# Altium project main_board.PrjPcb
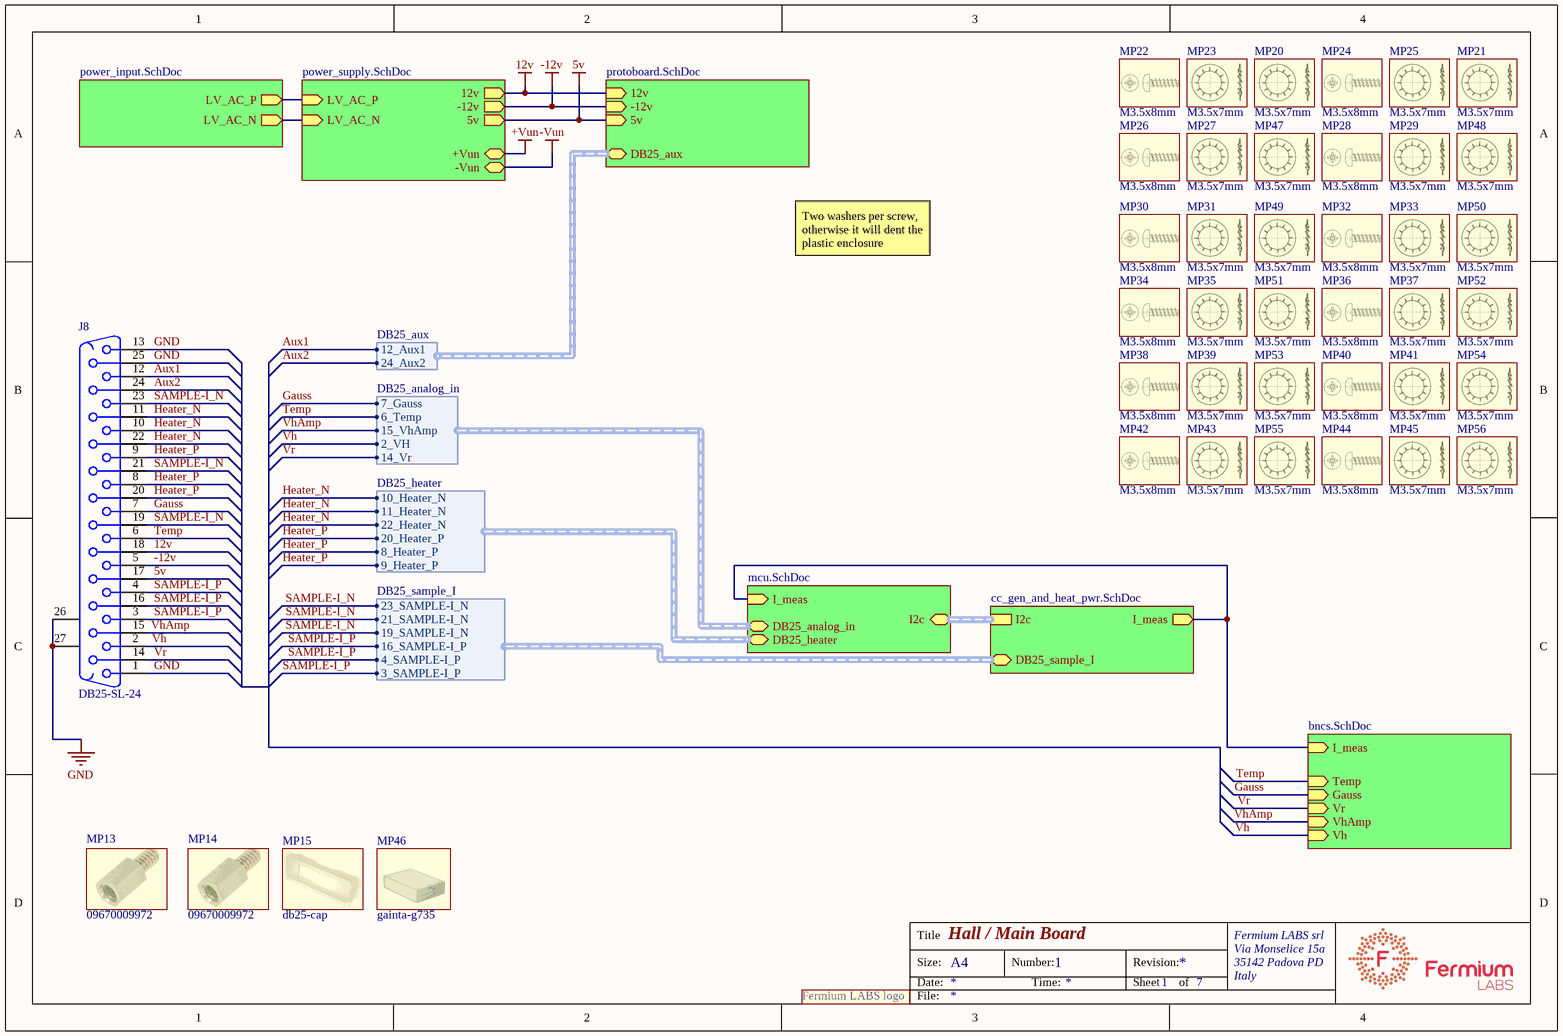
[diagram p0: main_board.SchDoc]
3 sheets, 105 parts. Net scope: hierarchical (ports join the sheet entries above them; power ports are global).
Board file: main_board.PcbDoc
Sheets:
  main_board.SchDoc
     = bncs.SchDoc
     = power_supply.SchDoc

## Sheet main_board.SchDoc: Hall / Main Board
size A4; DocumentNumber: 1; SheetNumber: 1; SheetTotal: 7

### Parts
J8  Supplier Part Number 1: DB25-SL-24  [DB25]
logo  (no value)  [frm-med]  (no BOM)
MP13  09670009972  (mechanical)
MP14  09670009972  (mechanical)
MP15  db25-cap  (mechanical)
MP20  Size: M3.5x7mm  (hidden comment: rondella-dentata-m3.5_1)  (mechanical)
MP21  Size: M3.5x7mm  (hidden comment: rondella-dentata-m3.5_1)  (mechanical)
MP22  Size: M3.5x8mm  (hidden comment: screw-3.5x8-plasticc_1)  (mechanical)
MP23  Size: M3.5x7mm  (hidden comment: rondella-dentata-m3.5_1)  (mechanical)
MP24  Size: M3.5x8mm  (hidden comment: screw-3.5x8-plasticc_1)  (mechanical)
MP25  Size: M3.5x7mm  (hidden comment: rondella-dentata-m3.5_1)  (mechanical)
MP26  Size: M3.5x8mm  (hidden comment: screw-3.5x8-plasticc_1)  (mechanical)
MP27  Size: M3.5x7mm  (hidden comment: rondella-dentata-m3.5_1)  (mechanical)
MP28  Size: M3.5x8mm  (hidden comment: screw-3.5x8-plasticc_1)  (mechanical)
MP29  Size: M3.5x7mm  (hidden comment: rondella-dentata-m3.5_1)  (mechanical)
MP30  Size: M3.5x8mm  (hidden comment: screw-3.5x8-plasticc_1)  (mechanical)
MP31  Size: M3.5x7mm  (hidden comment: rondella-dentata-m3.5_1)  (mechanical)
MP32  Size: M3.5x8mm  (hidden comment: screw-3.5x8-plasticc_1)  (mechanical)
MP33  Size: M3.5x7mm  (hidden comment: rondella-dentata-m3.5_1)  (mechanical)
MP34  Size: M3.5x8mm  (hidden comment: screw-3.5x8-plasticc_1)  (mechanical)
MP35  Size: M3.5x7mm  (hidden comment: rondella-dentata-m3.5_1)  (mechanical)
MP36  Size: M3.5x8mm  (hidden comment: screw-3.5x8-plasticc_1)  (mechanical)
MP37  Size: M3.5x7mm  (hidden comment: rondella-dentata-m3.5_1)  (mechanical)
MP38  Size: M3.5x8mm  (hidden comment: screw-3.5x8-plasticc_1)  (mechanical)
MP39  Size: M3.5x7mm  (hidden comment: rondella-dentata-m3.5_1)  (mechanical)
MP40  Size: M3.5x8mm  (hidden comment: screw-3.5x8-plasticc_1)  (mechanical)
MP41  Size: M3.5x7mm  (hidden comment: rondella-dentata-m3.5_1)  (mechanical)
MP42  Size: M3.5x8mm  (hidden comment: screw-3.5x8-plasticc_1)  (mechanical)
MP43  Size: M3.5x7mm  (hidden comment: rondella-dentata-m3.5_1)  (mechanical)
MP44  Size: M3.5x8mm  (hidden comment: screw-3.5x8-plasticc_1)  (mechanical)
MP45  Size: M3.5x7mm  (hidden comment: rondella-dentata-m3.5_1)  (mechanical)
MP46  gainta-g735  (mechanical)
MP47  Size: M3.5x7mm  (hidden comment: rondella-dentata-m3.5_1)  (mechanical)
MP48  Size: M3.5x7mm  (hidden comment: rondella-dentata-m3.5_1)  (mechanical)
MP49  Size: M3.5x7mm  (hidden comment: rondella-dentata-m3.5_1)  (mechanical)
MP50  Size: M3.5x7mm  (hidden comment: rondella-dentata-m3.5_1)  (mechanical)
MP51  Size: M3.5x7mm  (hidden comment: rondella-dentata-m3.5_1)  (mechanical)
MP52  Size: M3.5x7mm  (hidden comment: rondella-dentata-m3.5_1)  (mechanical)
MP53  Size: M3.5x7mm  (hidden comment: rondella-dentata-m3.5_1)  (mechanical)
MP54  Size: M3.5x7mm  (hidden comment: rondella-dentata-m3.5_1)  (mechanical)
MP55  Size: M3.5x7mm  (hidden comment: rondella-dentata-m3.5_1)  (mechanical)
MP56  Size: M3.5x7mm  (hidden comment: rondella-dentata-m3.5_1)  (mechanical)

### Sub-sheets
? = bncs.SchDoc: Temp (in), Gauss (in), I_meas (in), Vr (in), VhAmp (in), Vh (in)
? = mcu.SchDoc (file not in this document): I2c (harness I2c), I_meas (in), DB25_analog_in (harness DB25_analog_in), DB25_heater (harness DB25_heater)
? = power_supply.SchDoc: 12v (out), -12v (out), 5v (out), LV_AC_P (in), LV_AC_N (in), +Vun, -Vun
? = cc_gen_and_heat_pwr.SchDoc (file not in this document): I2c (harness I2c), I_meas (out), DB25_sample_I (harness DB25_sample_I)
? = protoboard.SchDoc (file not in this document): 12v (in), -12v (in), 5v (in), DB25_aux (harness DB25_aux)
? = power_input.SchDoc (file not in this document): LV_AC_P (out), LV_AC_N (out)

### Harnesses
DB25_analog_in: 14_Vr, 15_VhAmp, 2_VH, 6_Temp, 7_Gauss
DB25_heater: 10_Heater_N, 11_Heater_N, 20_Heater_P, 22_Heater_N, 8_Heater_P, 9_Heater_P
DB25_sample_I: 16_SAMPLE-I_P, 19_SAMPLE-I_N, 21_SAMPLE-I_N, 23_SAMPLE-I_N, 3_SAMPLE-I_P, 4_SAMPLE-I_P
DB25_aux: 12_Aux1, 24_Aux2

### Nets
5v: J8.17 ; sheet /5v, sheet /5v
12v: J8.18 ; sheet /12v, sheet /12v
-12v: J8.5 ; sheet /-12v, sheet /-12v
GND: J8.1 J8.13 J8.25 J8.26(MH1) J8.27(MH2)
Aux1: J8.12 ; sheet /DB25_aux.12_Aux1
Aux2: J8.24 ; sheet /DB25_aux.24_Aux2
Gauss: J8.7 ; sheet /Gauss, sheet /DB25_analog_in.7_Gauss
Heater_N: J8.10 J8.11 J8.22 ; sheet /DB25_heater.10_Heater_N, sheet /DB25_heater.11_Heater_N, sheet /DB25_heater.22_Heater_N
Heater_P: J8.8 J8.9 J8.20 ; sheet /DB25_heater.20_Heater_P, sheet /DB25_heater.8_Heater_P, sheet /DB25_heater.9_Heater_P
SAMPLE-I_N: J8.19 J8.21 J8.23 ; sheet /DB25_sample_I.19_SAMPLE-I_N, sheet /DB25_sample_I.21_SAMPLE-I_N, sheet /DB25_sample_I.23_SAMPLE-I_N
SAMPLE-I_P: J8.3 J8.4 J8.16 ; sheet /DB25_sample_I.16_SAMPLE-I_P, sheet /DB25_sample_I.3_SAMPLE-I_P, sheet /DB25_sample_I.4_SAMPLE-I_P
Temp: J8.6 ; sheet /Temp, sheet /DB25_analog_in.6_Temp
Vh: J8.2 ; sheet /Vh, sheet /DB25_analog_in.2_VH
VhAmp: J8.15 ; sheet /VhAmp, sheet /DB25_analog_in.15_VhAmp
Vr: J8.14 ; sheet /Vr, sheet /DB25_analog_in.14_Vr
NetD1_A: sheet /I_meas, sheet /I_meas, sheet /I_meas
NetD19_A: sheet /LV_AC_P, sheet /LV_AC_P
NetD20_A: sheet /LV_AC_N, sheet /LV_AC_N

### Notes on the sheet
- Two washers per screw, otherwise it will dent the plastic enclosure
- Title
- Size:
- Date:
- A4
- Number:
- Time:
- Revision:
- Sheet
- of
- Fermium LABS srl
- Via Monselice 15a
- 35142 Padova PD
- Italy
- File:
- (in symbol fermiumlabs-logo) Fermium LABS logo

### Library data of the parts
J8 = D Connector 25: d-sub, 25 pins,  Right Angle; Manufacturer: ADAM TECH; Pads: 29 THT; Supplier 1: TME; Manufacturer Part Number: DB25-SL-24; Category: D-Sub connectors
logo = fermiumlabs-logo
MP13 MP14 = 09670009972: Manufacturer: HARTING; Supplier 1: TME; Supplier Part Number 1: 09670009972; Manufacturer Part Number: 09670009972
MP15 = db25-cap: Manufacturer Part Number: 2105-0100-03; Manufacturer: Encitech; Supplier 1: TME; Supplier Part Number 1: DC25-P
MP20 MP21 MP23 MP25 MP27 MP29 MP31 MP33 MP35 MP37 MP39 MP41 MP43 MP45 MP47-MP56 = rondella-dentata-m3.5_1: Manufacturer Part Number: M3.5/BN782 DIN6798J; Manufacturer: BOSSARD; Supplier 1: TME; Supplier Part Number 1: B3.5/BN782
MP22 MP24 MP26 MP28 MP30 MP32 MP34 MP36 MP38 MP40 MP42 MP44 = screw-3.5x8-plasticc_1: Manufacturer Part Number: M3.5X8/BN82428; Manufacturer: BOSSARD; Supplier 1: TME; Supplier Part Number 1: B3.5X8/BN82428
MP46 = gainta-g735: Manufacturer Part Number: G735; Manufacturer: GAINTA; Supplier 1: TME; Supplier Part Number 1: G735

## Sheet bncs.SchDoc: Hall / Main Board / BNCs
size A4; DocumentNumber: 2; SheetNumber: 2; SheetTotal: 7
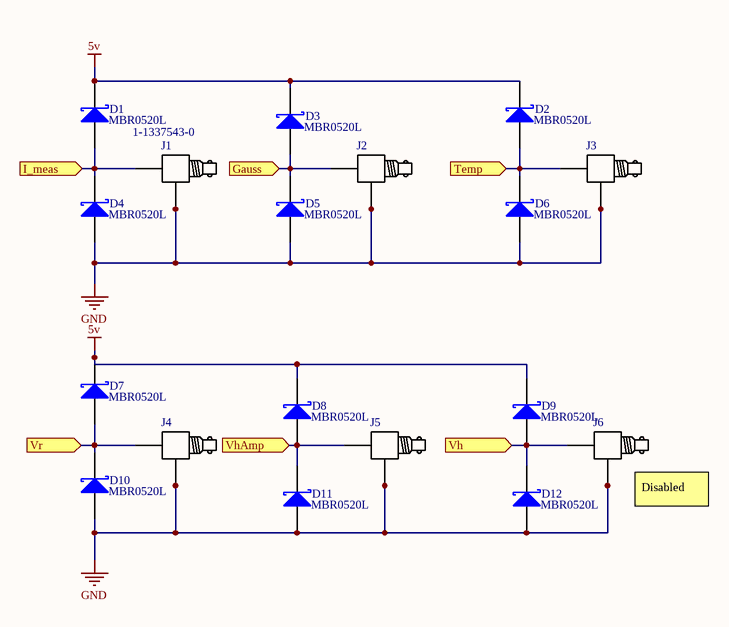
[diagram p1: bncs.SchDoc]

### Parts
D1  Supplier Part Number 1: MBR0520L  [SOD123]
D2  Supplier Part Number 1: MBR0520L  [SOD123]
D3  Supplier Part Number 1: MBR0520L  [SOD123]
D4  Supplier Part Number 1: MBR0520L  [SOD123]
D5  Supplier Part Number 1: MBR0520L  [SOD123]
D6  Supplier Part Number 1: MBR0520L  [SOD123]
D7  Supplier Part Number 1: MBR0520L  [SOD123]
D8  Supplier Part Number 1: MBR0520L  [SOD123]
D9  Supplier Part Number 1: MBR0520L  [SOD123]
D10  Supplier Part Number 1: MBR0520L  [SOD123]
D11  Supplier Part Number 1: MBR0520L  [SOD123]
D12  Supplier Part Number 1: MBR0520L  [SOD123]
J1  Supplier Part Number 1: 1-1337543-0  [BNC-RA]
J2  (no value)  [BNC-RA]
J3  (no value)  [BNC-RA]
J4  (no value)  [BNC-RA]
J5  (no value)  [BNC-RA]
J6  (no value)  [BNC-RA]

### Ports
Gauss (in), I_meas (in), Temp (in), Vh (in), VhAmp (in), Vr (in)

### Nets
5v: D1.K D2.K D3.K D7.K D8.K D9.K
GND: D4.A D5.A D6.A D10.A D11.A D12.A J1.2(gnd) J1.A J1.B J2.2(gnd) J2.A J2.B J3.2(gnd) J3.A J3.B J4.2(gnd) J4.A J4.B J5.2(gnd) J5.A J5.B J6.2(gnd) J6.A J6.B
Gauss: D3.A D5.K J2.1 ; port Gauss
Temp: D2.A D6.K J3.1 ; port Temp
Vh: D9.A D12.K J6.1 ; port Vh
VhAmp: D8.A D11.K J5.1 ; port VhAmp
Vr: D7.A D10.K J4.1 ; port Vr
NetD1_A: D1.A D4.K J1.1 ; port I_meas

### Notes on the sheet
- (near J6) Disabled
- Title
- Size:
- Date:
- A4
- Number:
- Time:
- Revision:
- Sheet
- of
- Fermium LABS srl
- Via Monselice 15a
- 35142 Padova PD
- Italy
- File:

### Library data of the parts
D1-D9 D11 D12 = D Schottky: Schottky Diode; Manufacturer: FAIRCHILD SEMICONDUCTOR; Unit: pcs; SuppliedAmount: 0; MinAmount: 10; Multiples: 1; Diode type: Schottky rectifying; Off state voltage max.: 20V; Forward voltage at If: 390mV; Load current: 500mA; Pads: 2 SMD; Published: 8-Jun-2000; LatestRevisionDate: 17-Jul-2002; LatestRevisionNote: Re-released for DXP Platform.; PackageReference: SMB; Publisher: Altium Limited; PackageDescription: DO-214-AA/SMB; 2 C-Bend Leads; Body 5.3 x 3.6 mm, inc. leads (LxW); Code_JEDEC: DO-214-AA; Supplier 1: TME; Manufacturer Part Number: MBR0520L; Category: SMD Schottky Diodes; Stock 1: 24595; Pricing 1: 10=0.0403, 50=0.0376, 250=0.0333, 1000=0.03, 3000=0.0281 (EUR); Weight: 0.032; Case: SOD123; Mounting: SMD; Price Type: NET; ComponentLink1URL: http://static.tme.eu/products_pics/e/d/b/edbd030cb344fc64745afa0f91101952/285567.jpg; ComponentLink1Description: http://static.tme.eu/products_pics/e/d/b/edbd030cb344fc64745afa0f91101952/285567.jpg
D10 = D Schottky: Schottky Diode; Manufacturer: FAIRCHILD SEMICONDUCTOR; Unit: pcs; SuppliedAmount: 0; MinAmount: 10; Multiples: 1; Diode type: Schottky rectifying; Off state voltage max.: 20V; Forward voltage at If: 390mV; Load current: 500mA; 2: SMD; Pads: 2 SMD; Published: 8-Jun-2000; LatestRevisionDate: 17-Jul-2002; LatestRevisionNote: Re-released for DXP Platform.; PackageReference: SMB; Publisher: Altium Limited; PackageDescription: DO-214-AA/SMB; 2 C-Bend Leads; Body 5.3 x 3.6 mm, inc. leads (LxW); Code_JEDEC: DO-214-AA; Supplier 1: TME; Manufacturer Part Number: MBR0520L; Category: SMD Schottky Diodes; Stock 1: 24595; Pricing 1: 10=0.0403, 50=0.0376, 250=0.0333, 1000=0.03, 3000=0.0281 (EUR); Weight: 0.032; Case: SOD123; Mounting: SMD; Price Type: NET; ComponentLink1URL: http://static.tme.eu/products_pics/e/d/b/edbd030cb344fc64745afa0f91101952/285567.jpg; ComponentLink1Description: http://static.tme.eu/products_pics/e/d/b/edbd030cb344fc64745afa0f91101952/285567.jpg
J1 = BNC-PCB-RA: connector bnc; Manufacturer: TE CONNECTIVITY; Unit: pcs; SuppliedAmount: 0; MinAmount: 1; Connector: socket; Connector variant: insulated; Spatial orientation: angled 90°; Wave impedance: 50Ω; Electrical mounting: THT; Mechanical mounting: on PCBs; Insulator material: polyester; Pads: 4 THT; Supplier 1: TME; Manufacturer Part Number: 1-1337543-0; Category: BNC connectors; Stock 1: 44; Pricing 1: 1=1.22, 25=1.1, 100=0.98, 1000=0.86 (EUR); Weight: 13.22; Multiples: 1; Connector type: BNC; Contact plating: gold plated; Price Type: NET; ComponentLink1URL: http://static.tme.eu/products_pics/6/3/2/63240353f8a8790dbe8f7bd93b014c1a/378606.jpg; ComponentLink1Description: http://static.tme.eu/products_pics/6/3/2/63240353f8a8790dbe8f7bd93b014c1a/378606.jpg
J2-J6 = BNC-PCB-RA: connector bnc; Manufacturer: TE CONNECTIVITY; Manufacturer Part Number: 1-1337543-0; Unit: pcs; SuppliedAmount: 0; MinAmount: 1; Connector: socket; Connector variant: insulated; Spatial orientation: angled 90°; Wave impedance: 50Ω; Electrical mounting: THT; Mechanical mounting: on PCBs; Insulator material: polyester; Pads: 4 THT; Supplier 1: TME; Supplier Part Number 1: 1-1337543-0; Category: BNC connectors; Stock 1: 44; Pricing 1: 1=1.22, 25=1.1, 100=0.98, 1000=0.86 (EUR); Weight: 13.22; Multiples: 1; Connector type: BNC; Contact plating: gold plated; Price Type: NET; ComponentLink1URL: http://static.tme.eu/products_pics/6/3/2/63240353f8a8790dbe8f7bd93b014c1a/378606.jpg; ComponentLink1Description: http://static.tme.eu/products_pics/6/3/2/63240353f8a8790dbe8f7bd93b014c1a/378606.jpg

## Sheet power_supply.SchDoc: Hall / Main Board / Power Supply
size A4; DocumentNumber: 6; SheetNumber: 6; SheetTotal: 7
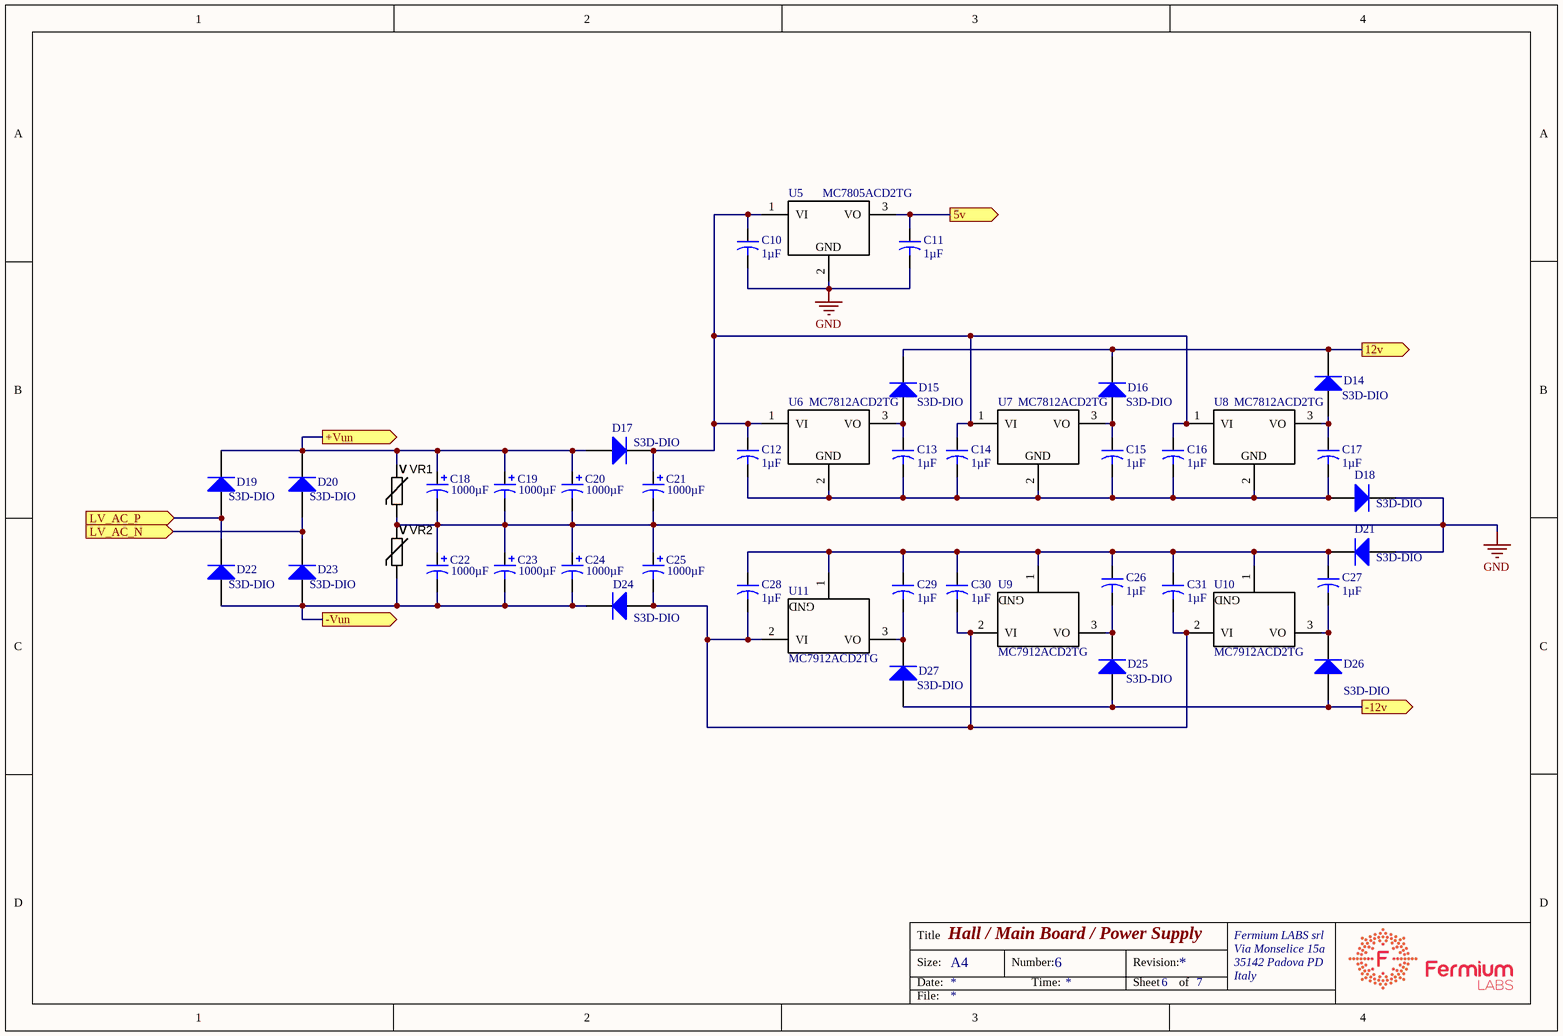
[diagram p2: power_supply.SchDoc]

### Parts
C10  Capacitance: 1µF  [CAP 0805/2012]
C11  Capacitance: 1µF  [CAP 0805/2012]
C12  Capacitance: 1µF  [CAP 0805/2012]
C13  Capacitance: 1µF  [CAP 0805/2012]
C14  Capacitance: 1µF  [CAP 0805/2012]
C15  Capacitance: 1µF  [CAP 0805/2012]
C16  Capacitance: 1µF  [CAP 0805/2012]
C17  Capacitance: 1µF  [CAP 0805/2012]
C18  Capacitance: 1000µF  [CAPE5.0mm]
C19  Capacitance: 1000µF  [CAPE5.0mm]
C20  Capacitance: 1000µF  [CAPE5.0mm]
C21  Capacitance: 1000µF  [CAPE5.0mm]
C22  Capacitance: 1000µF  [CAPE5.0mm]
C23  Capacitance: 1000µF  [CAPE5.0mm]
C24  Capacitance: 1000µF  [CAPE5.0mm]
C25  Capacitance: 1000µF  [CAPE5.0mm]
C26  Capacitance: 1µF  [CAP 0805/2012]
C27  Capacitance: 1µF  [CAP 0805/2012]
C28  Capacitance: 1µF  [CAP 0805/2012]
C29  Capacitance: 1µF  [CAP 0805/2012]
C30  Capacitance: 1µF  [CAP 0805/2012]
C31  Capacitance: 1µF  [CAP 0805/2012]
D14  Supplier Part Number 1: S3D-DIO  [DIODE-SMC]
D15  Supplier Part Number 1: S3D-DIO  [DIODE-SMC]
D16  Supplier Part Number 1: S3D-DIO  [DIODE-SMC]
D17  Supplier Part Number 1: S3D-DIO  [DIODE-SMC]
D18  Supplier Part Number 1: S3D-DIO  [DIODE-SMC]
D19  Supplier Part Number 1: S3D-DIO  [DIODE-SMC]
D20  Supplier Part Number 1: S3D-DIO  [DIODE-SMC]
D21  Supplier Part Number 1: S3D-DIO  [DIODE-SMC]
D22  Supplier Part Number 1: S3D-DIO  [DIODE-SMC]
D23  Supplier Part Number 1: S3D-DIO  [DIODE-SMC]
D24  Supplier Part Number 1: S3D-DIO  [DIODE-SMC]
D25  Supplier Part Number 1: S3D-DIO  [DIODE-SMC]
D26  Supplier Part Number 1: S3D-DIO  [DIODE-SMC]
D27  Supplier Part Number 1: S3D-DIO  [DIODE-SMC]
U5  Supplier Part Number 1: MC7805ACD2TG  [D2PAK-3]
U6  Supplier Part Number 1: MC7812ACD2TG  [D2PAK-3]
U7  Supplier Part Number 1: MC7812ACD2TG  [D2PAK-3]
U8  Supplier Part Number 1: MC7812ACD2TG  [D2PAK-3]
U9  Supplier Part Number 1: MC7912ACD2TG  [D2PAK-3]
U10  Supplier Part Number 1: MC7912ACD2TG  [D2PAK-3]
U11  Supplier Part Number 1: MC7912ACD2TG  [D2PAK-3]
VR1  (no value)  [CAP 1206/3216 - 1.8MM]
VR2  (no value)  [CAP 1206/3216 - 1.8MM]

### Ports
5v (out), 12v (out), +Vun (out), -12v (out), -Vun (out), LV_AC_N (in), LV_AC_P (in)

### Nets
5v: C11.1 U5.3(VO) ; port 5v
12v: D14.K D15.K D16.K ; port 12v
+Vun: C18.1 C19.1 C20.1 D17.A D19.K D20.K VR1.1 ; port +Vun
-12v: D25.A D26.A D27.A ; port -12v
-Vun: C22.2 C23.2 C24.2 D22.A D23.A D24.K VR2.2 ; port -Vun
GND: C10.2 C11.2 C18.2 C19.2 C20.2 C21.2 C22.1 C23.1 C24.1 C25.1 D18.K D21.A U5.2 VR1.2 VR2.1
NetC10_1: C10.1 C12.1 C14.1 C16.1 C21.1 D17.K U5.1(VI) U6.1(VI) U7.1(VI) U8.1(VI)
NetC12_2: C12.2 C13.2 C14.2 C15.2 C16.2 C17.2 D18.A U6.2 U7.2 U8.2
NetC13_1: C13.1 D15.A U6.3(VO)
NetC15_1: C15.1 D16.A U7.3(VO)
NetC17_1: C17.1 D14.A U8.3(VO)
NetC25_2: C25.2 C28.2 C30.2 C31.2 D24.A U9.2(VI) U10.2(VI) U11.2(VI)
NetC26_1: C26.1 C27.1 C28.1 C29.1 C30.1 C31.1 D21.K U9.1 U10.1 U11.1
NetC26_2: C26.2 D25.K U9.3(VO)
NetC27_2: C27.2 D26.K U10.3(VO)
NetC29_2: C29.2 D27.K U11.3(VO)
NetD19_A: D19.A D22.K ; port LV_AC_P
NetD20_A: D20.A D23.K ; port LV_AC_N

### Notes on the sheet
- Title
- Size:
- Date:
- A4
- Number:
- Time:
- Revision:
- Sheet
- of
- Fermium LABS srl
- Via Monselice 15a
- 35142 Padova PD
- Italy
- File:
- (in symbol L7805-TO220) GND
- (in symbol L7815-TO220) GND
- (in symbol L7915-TO220) GND
- (in symbol Varistor_MOV) V

### Library data of the parts
C10-C17 C26-C31 = Cap2: Capacitor; Manufacturer: SAMSUNG; Manufacturer Part Number: CL21B105KAFNNNE; Unit: pcs; SuppliedAmount: 0; MinAmount: 100; Capacitor type: ceramic; Capacitor kind: MLCC; Operating voltage: 25V; Dielectric: X7R; Tolerance: ±10%; Case - inch: 0805; Case - mm: 2012; Pads: 2 SMD; Published: 23-Sep-2002; PackageReference: CAPR5-4X5; Publisher: Altium Limited; PackageDescription: Capacitor; 2 Leads; Supplier 1: TME; Supplier Part Number 1: CL21B105KAFNNNE; Category: 0805 MLCC SMD Capacitors; Stock 1: 56790; Pricing 1: 100=0.0108, 300=0.00924, 1000=0.00748, 2000=0.006, 6000=0.0058 (EUR); Weight: 0.039; Multiples: 100; Mounting: SMD; Operating temperature: -55...125°C; Price Type: NET; ComponentLink1URL: http://static.tme.eu/products_pics/d/b/b/dbbd93eaf25225110ca26eb66da77328/58538.jpg; ComponentLink1Description: http://static.tme.eu/products_pics/d/b/b/dbbd93eaf25225110ca26eb66da77328/58538.jpg
C18-C24 = Cap Pol1: capacitor , electrolytic; Manufacturer: United Chemi-Con; Manufacturer Part Number: EKYB250ELL102MJ20S; Pads: 2 THT; Description: Aluminum Electrolytic Capacitors - Leaded 25V 1000uF 20% Tol.; Featured Product: United Chemi-Con - KYB Series Aluminum Electrolytic Capacitors; Tolerance: ±20%; Voltage Rating: 25V; Lifetime @ Temp.: 10000 Hrs @ 105°C; Ripple Current: 1.65A; Impedance: 37 mOhm; Online Catalog: KYB Series; Other Names: 565-3892; Supplier 1: Mouser; Supplier Part Number 1: 661-EKYB250E102MJ20S; Stock 1: 908; Pricing 1: 1=0.69, 10=0.507, 50=0.387, 100=0.348, 1000=0.232, 10000=0.187 (USD); Standard Package: 2,000; Category: Capacitors; Family: Aluminum Capacitors; Series: KYB; Packaging: Bulk; ESR (Equivalent Series Resistance): -; Operating Temperature: -40°C ~ 105°C; Polarization: -; Applications: General Purpose; Lead Spacing: 0.197" (5.00mm); Size / Dimension: 0.394" Dia (10.00mm); Height - Seated (Max): 0.846" (21.50mm); Surface Mount Land Size: -; Mounting Type: Through Hole; Package / Case: Radial, Can; ComponentLink1URL: https://datasheet.ciiva.com/31837/al-kyb-bulletin826a-e-121112-31837781.pdf; ComponentLink1Description: https://datasheet.ciiva.com/31837/al-kyb-bulletin826a-e-121112-31837781.pdf
C25 = Cap Pol1: capacitor , electrolytic; Manufacturer: United Chemi-Con; Manufacturer Part Number: EKYB250ELL102MJ20S; Description: Aluminum Electrolytic Capacitors - Leaded 25V 1000uF 20% Tol.; Featured Product: United Chemi-Con - KYB Series Aluminum Electrolytic Capacitors; Tolerance: ±20%; Voltage Rating: 25V; Lifetime @ Temp.: 10000 Hrs @ 105°C; Ripple Current: 1.65A; Impedance: 37 mOhm; Online Catalog: KYB Series; Other Names: 565-3892; Supplier 1: Mouser; Supplier Part Number 1: 661-EKYB250E102MJ20S; Stock 1: 908; Pricing 1: 1=0.69, 10=0.507, 50=0.387, 100=0.348, 1000=0.232, 10000=0.187 (USD); Standard Package: 2,000; Category: Capacitors; Family: Aluminum Capacitors; Series: KYB; Packaging: Bulk; ESR (Equivalent Series Resistance): -; Operating Temperature: -40°C ~ 105°C; Polarization: -; Applications: General Purpose; Lead Spacing: 0.197" (5.00mm); Size / Dimension: 0.394" Dia (10.00mm); Height - Seated (Max): 0.846" (21.50mm); Surface Mount Land Size: -; Mounting Type: Through Hole; Package / Case: Radial, Can; ComponentLink1URL: https://datasheet.ciiva.com/31837/al-kyb-bulletin826a-e-121112-31837781.pdf; ComponentLink1Description: https://datasheet.ciiva.com/31837/al-kyb-bulletin826a-e-121112-31837781.pdf
D14-D27 = Diode 1N4007: Diode rectifier 1A; Manufacturer: DIOTEC SEMICONDUCTOR; Manufacturer Part Number: S3D; Pads: 2 SMD; Supplier 1: TME; Case: DO214AB
U5 = L7805-TO220: Voltage regulator, 5V; Manufacturer: ON SEMICONDUCTOR; Unit: pcs; SuppliedAmount: 0; MinAmount: 2; Multiples: 1; Integrated circuit type: voltage stabiliser; Kind of voltage regulator: fixed; Output current: 1A; Pads: 3 SMD; Supplier 1: TME; Manufacturer Part Number: MC7805ACD2TG; Category: Unregulated Voltage Regulators; Stock 1: 245; Pricing 1: 2=0.45, 10=0.42, 50=0.38, 250=0.322 (EUR); Weight: 2.18; Output voltage: 5V; Case: D2PAK; Mounting: SMD; Package type: tube; Price Type: NET; ComponentLink1URL: http://static.tme.eu/products_pics/e/a/8/ea8bf400c57f85e1fa510dcd027ce484/59301.jpg; ComponentLink1Description: http://static.tme.eu/products_pics/e/a/8/ea8bf400c57f85e1fa510dcd027ce484/59301.jpg
U6-U8 = L7815-TO220: Voltage regulator, 15V; Manufacturer: ON SEMICONDUCTOR; Unit: pcs; SuppliedAmount: 0; MinAmount: 1; Integrated circuit type: voltage stabiliser; Kind of voltage regulator: fixed; Output voltage: 12V; Output current: 1A; Pads: 3 SMD; Supplier 1: TME; Manufacturer Part Number: MC7812ACD2TG; Category: Unregulated Voltage Regulators; Stock 1: 415; Pricing 1: 1=0.5, 5=0.449, 25=0.41, 100=0.357, 500=0.299 (EUR); Weight: 1.997; Multiples: 1; Case: D2PAK; Mounting: SMD; Package type: tube; Price Type: NET; ComponentLink1URL: http://static.tme.eu/products_pics/e/a/8/ea8bf400c57f85e1fa510dcd027ce484/59301.jpg; ComponentLink1Description: http://static.tme.eu/products_pics/e/a/8/ea8bf400c57f85e1fa510dcd027ce484/59301.jpg
U9-U11 = L7915-TO220: Voltage regulator-15.0V; Manufacturer: ON SEMICONDUCTOR; Unit: pcs; SuppliedAmount: 0; MinAmount: 1; Integrated circuit type: voltage stabiliser; Kind of voltage regulator: fixed; Output voltage: -12V; Output current: 1A; Pads: 3 SMD; Supplier 1: TME; Manufacturer Part Number: MC7912ACD2TG; Category: Unregulated Voltage Regulators; Stock 1: 441; Pricing 1: 1=0.628, 5=0.56, 25=0.465, 100=0.39, 500=0.34 (EUR); Weight: 1.876; Multiples: 1; Case: D2PAK; Mounting: SMD; Package type: tube; Price Type: NET; ComponentLink1URL: http://static.tme.eu/products_pics/e/a/8/ea8bf400c57f85e1fa510dcd027ce484/59301.jpg; ComponentLink1Description: http://static.tme.eu/products_pics/e/a/8/ea8bf400c57f85e1fa510dcd027ce484/59301.jpg
VR1 VR2 = Varistor_MOV: Varistor; Manufacturer: EPCOS; Manufacturer Part Number: B72520T0250K062; Unit: pcs; SuppliedAmount: 0; MinAmount: 5; Multiples: 1; Varistor type: metal-oxide; Max. operating voltage: 25V AC; Energy 2 ms: 1J; Varistor max current 8/20µs: 200A; Power: 8mW; Pads: 2 SMD; Supplier 1: TME; Supplier Part Number 1: B72520T250K62; Category: SMD Varistors; Stock 1: 1646; Pricing 1: 5=0.194, 50=0.158, 100=0.128, 500=0.119, 2000=0.114 (EUR); Weight: 0.058; Mounting: SMD; Case: 1206; Price Type: NET; ComponentLink1URL: http://static.tme.eu/products_pics/c/0/9/c09a96f753270fa18ba9e61c943ff8c8/58311.jpg; ComponentLink1Description: http://static.tme.eu/products_pics/c/0/9/c09a96f753270fa18ba9e61c943ff8c8/58311.jpg

## Nets that join several sheets
5v: main_board (J8.17), bncs (6 pins), power_supply (C11.1 U5.3)
12v: main_board (J8.18), power_supply (D14.K D15.K D16.K)
-12v: main_board (J8.5), power_supply (D25.A D26.A D27.A)
GND: main_board (5 pins), bncs (24 pins), power_supply (15 pins)
Gauss: main_board (J8.7), bncs (D3.A D5.K J2.1)
Temp: main_board (J8.6), bncs (D2.A D6.K J3.1)
Vh: main_board (J8.2), bncs (D9.A D12.K J6.1)
VhAmp: main_board (J8.15), bncs (D8.A D11.K J5.1)
Vr: main_board (J8.14), bncs (D7.A D10.K J4.1)